# EAGLE design FES (EAGLE 9.6.2)
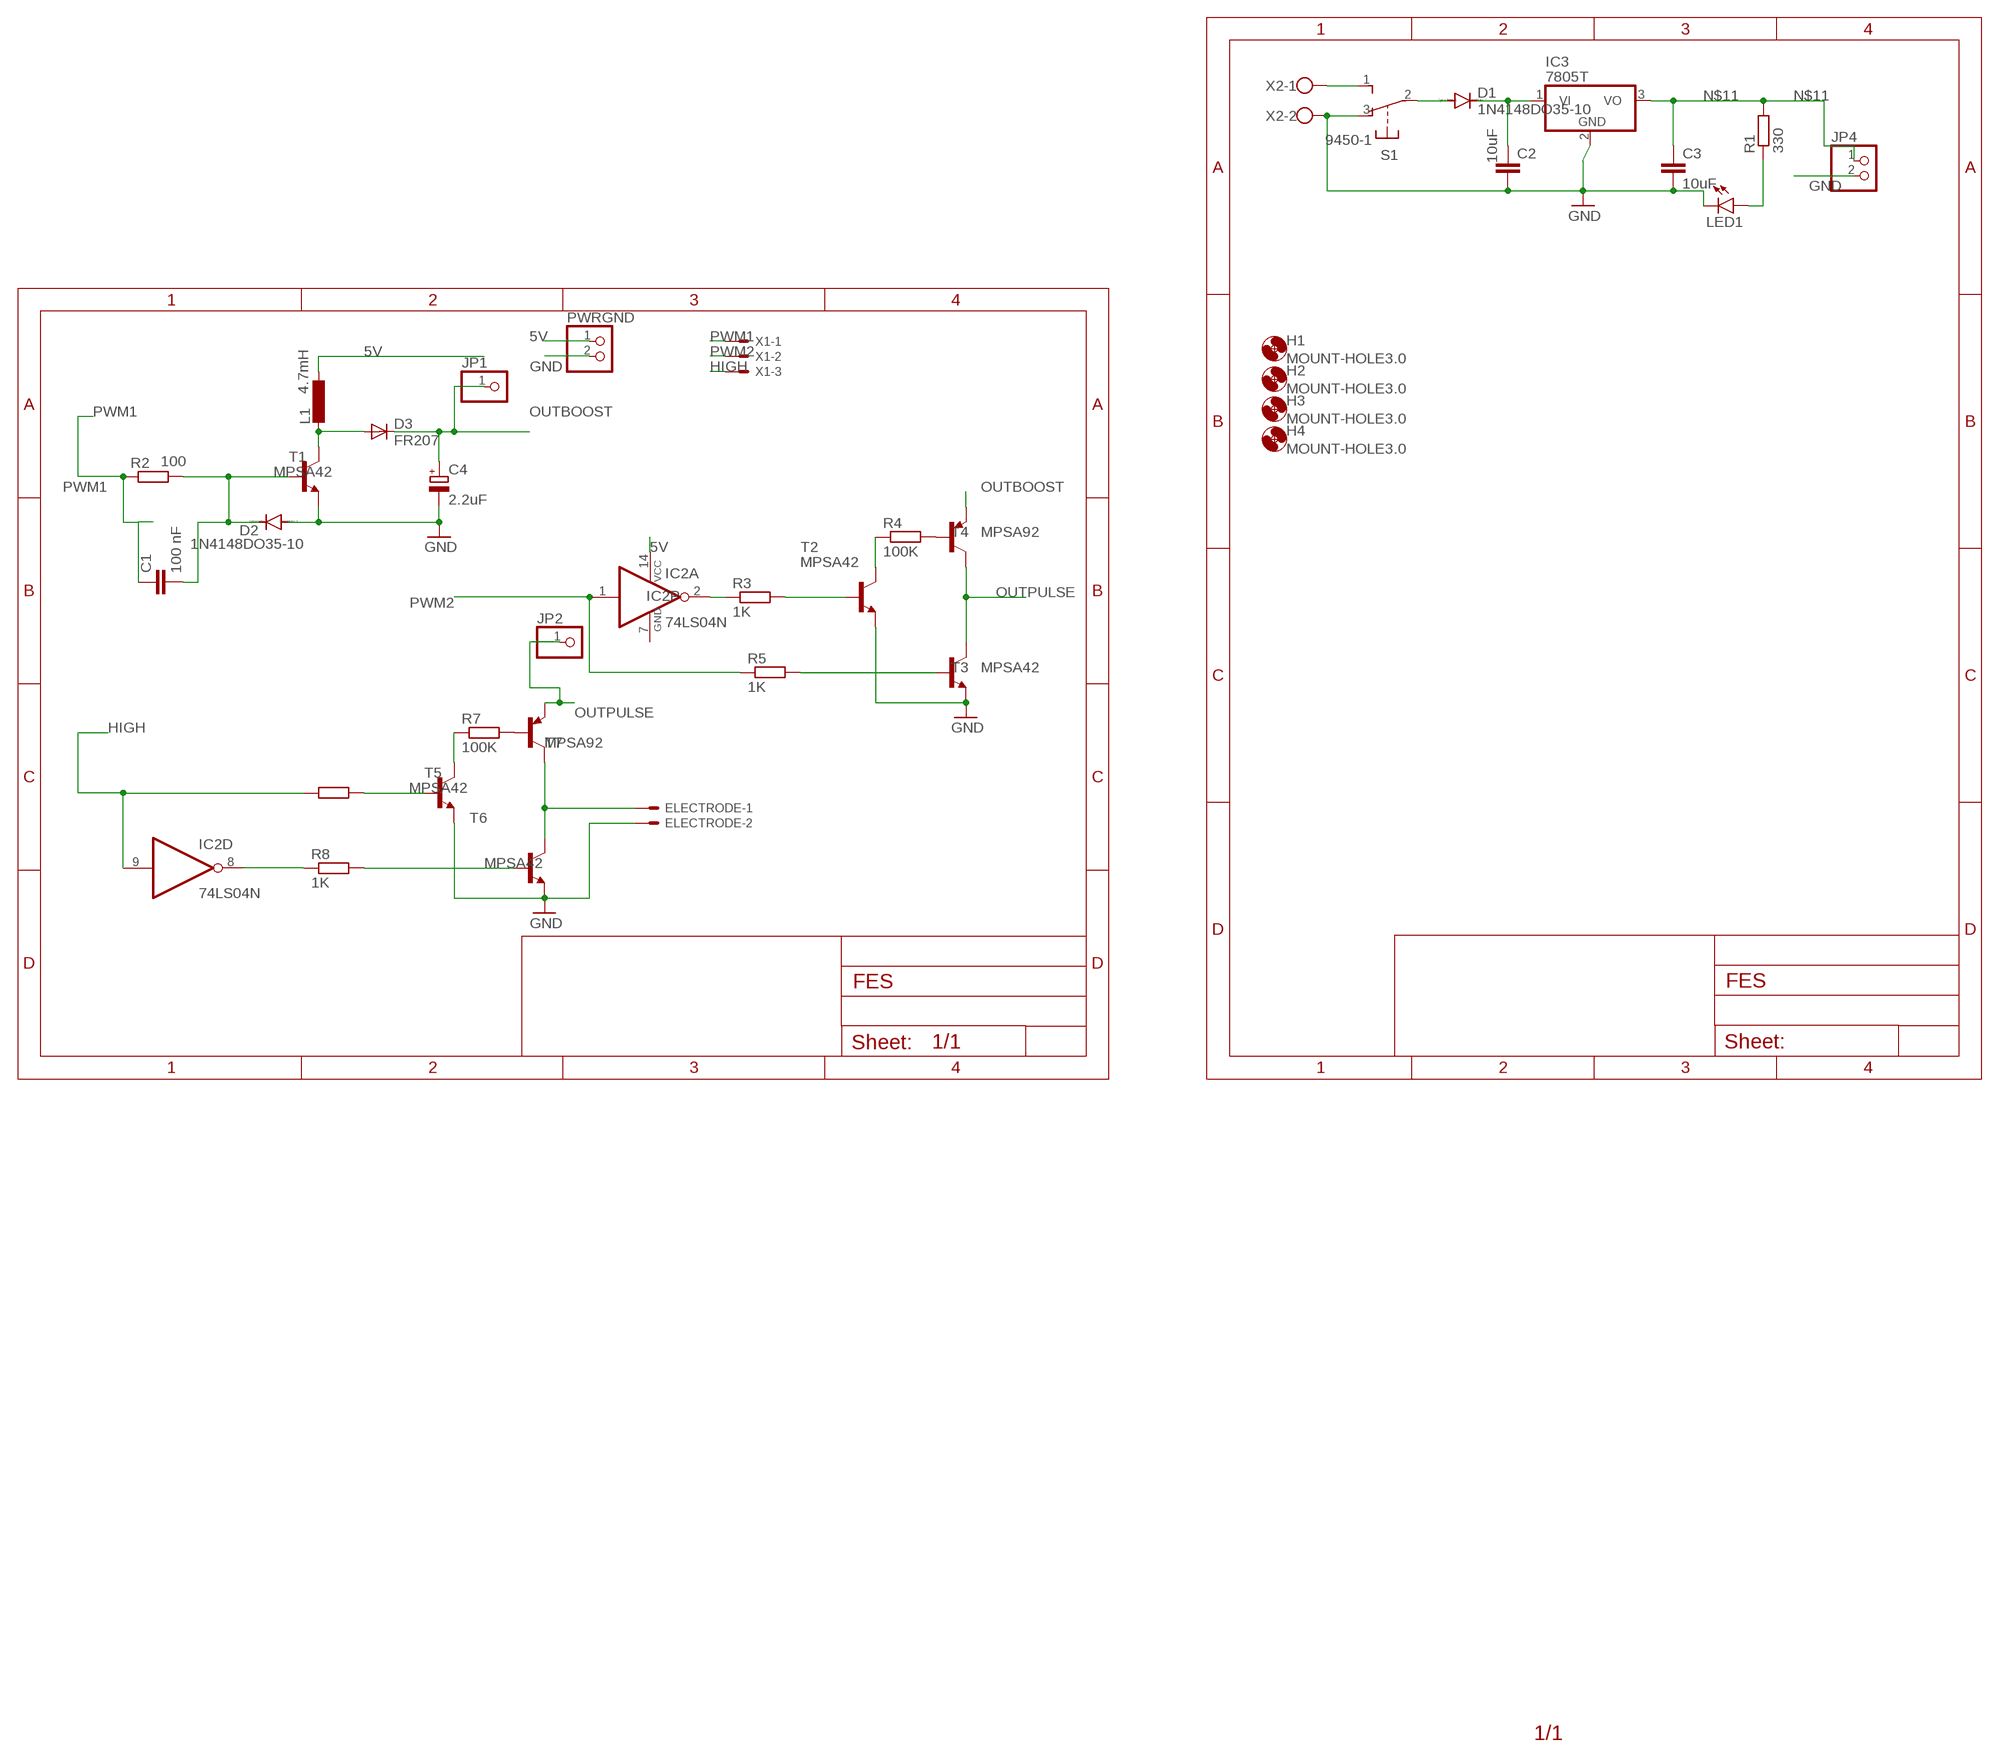
[diagram p0: schematic, sheet 1]

## Parts
C1  100 nF  C5/2.5  [C5B2.5]
C2  10uF  C2.5/2  [C2.5-2]
C3  10uF  C2.5/2  [C2.5-2]
C4  2.2uF  CPOL-EUE5-10.5  [E5-10,5]
D1  1N4148DO35-10  [DO35-10]
D2  1N4148DO35-10  [DO35-10]
D3  FR207  [DO15-12]
ELECTRODE  22-23-2021  [22-23-2021]
H1  MOUNT-HOLE3.0  [3,0]
H2  MOUNT-HOLE3.0  [3,0]
H3  MOUNT-HOLE3.0  [3,0]
H4  MOUNT-HOLE3.0  [3,0]
IC2  74LS04N  [DIL14]
IC3  7805T  [TO220H]
JP1  PINHD-1X1  [1X01]
JP2  PINHD-1X1  [1X01]
JP4  PINHD-1X2  [1X02]
L1  4.7mH  L-EU0207/12  [0207/12]
LED1  LED3MM  [LED3MM]
PWRGND  PINHD-1X2  [1X02]
R1  330  R-EU_0207/10  [0207/10]
R2  100  R-EU_0207/10  [0207/10]
R3  1K  R-EU_0207/10  [0207/10]
R4  100K  R-EU_0207/10  [0207/10]
R5  1K  R-EU_0207/10  [0207/10]
R6  1K  R-EU_0207/10  [0207/10]
R7  100K  R-EU_0207/10  [0207/10]
R8  1K  R-EU_0207/10  [0207/10]
S1  9450-1  [9450-1]
T1  MPSA42  MPSA42-NPN-TO92-EBC  [TO92-EBC]
T2  MPSA42  MPSA42-NPN-TO92-EBC  [TO92-EBC]
T3  MPSA42  MPSA42-NPN-TO92-EBC  [TO92-EBC]
T4  MPSA92  MPSA92-PNP-TO92-EBC  [TO92-EBC]
T5  MPSA42  MPSA42-NPN-TO92-EBC  [TO92-EBC]
T6  MPSA42  MPSA42-NPN-TO92-EBC  [TO92-EBC]
T7  MPSA92  MPSA92-PNP-TO92-EBC  [TO92-EBC]
X1  22-23-2031  [22-23-2031]
X2  W237-102  [W237-102]

## Nets
5V: IC2.14(P:VCC) L1.1 PWRGND.1
GND: C2.2 C3.2 C4.- D2.A ELECTRODE.2 IC3.2(GND) JP4.2 LED1.K(C) PWRGND.2 S1.3(O) T1.E T2.E T3.E T5.E T6.E X2.2
HIGH: IC2.9(D:I) R6.1 X1.3
N$1: C1.2 D2.C R2.2 T1.B
N$2: S1.1(S) X2.1
N$3: D3.A L1.2 T1.C
N$4: C2.1 D1.C IC3.1(VI)
N$5: R4.2 T4.B
N$6: IC2.2(A:O) R3.1
N$7: R3.2 T2.B
N$9: R4.1 T2.C
N$10: R7.2 T7.B
N$11: C3.1 IC3.3(VO) JP4.1 R1.2
N$12: IC2.8(D:O) R8.1
N$13: R5.2 T3.B
N$14: R6.2 T5.B
N$15: R7.1 T5.C
N$16: ELECTRODE.1 T6.C T7.C
N$17: R8.2 T6.B
N$51: LED1.A R1.1
N$52: D1.A S1.2(P)
OUTBOOST: C4.+ D3.C JP1.1 T4.E
OUTPULSE: JP2.1 T3.C T4.C T7.E
PWM1: C1.1 R2.1 X1.1
PWM2: IC2.1(A:I) R5.1 X1.2
Unconnected: IC2.3(B:I) IC2.4(B:O) IC2.5(C:I) IC2.6(C:O) IC2.10(E:O) IC2.11(E:I) IC2.12(F:O) IC2.13(F:I)

## Power pins joined to a net without a drawn wire
GND: IC2.7(P:GND)

## Library data of the parts
C1-C3 = capacitor-wima:C: CAPACITOR naming: grid - package width
C4 = rcl:CPOL-EU: POLARIZED CAPACITOR, European symbol; SPICEPREFIX: C
D1 D2 = diode:1N4148: DIODE high speed (Philips)
D3 = FR207:FR207: Fast recovery Diode 1000V 2A Check availability <https://pricing.snapeda.com/parts/FR207/Taiwan%20Semiconductor%20Corporation/view-part?ref=eda>; AVAILABILITY: In Stock; DESCRIPTION: Diode Standard 2A Through Hole DO-204AC (DO-15); MF: Taiwan Semiconductor Corporation; MP: FR207; PACKAGE: None; PRICE: None; PURCHASE-URL: https://pricing.snapeda.com/search/part/FR207/?ref=eda
ELECTRODE = con-molex:22-23-2021: .100" (2.54mm) Center Header - 2 Pin; MF: MOLEX; MPN: 22-23-2021; OC_FARNELL: 1462926; OC_NEWARK: 25C3832
H1-H4 = holes:MOUNT-HOLE: MOUNTING HOLE with drill center marker
IC2 = 74xx-eu:74*04: Hex INVERTER
IC3 = linear:78*: Positive VOLTAGE REGULATOR Source: http://cache.national.com/ds/LM/LM78L05.pdf http://www.fairchildsemi.com/ds/LM/LM7805.pdf
JP1 JP2 = pinhead:PINHD-1X1: PIN HEADER
JP4 PWRGND = pinhead:PINHD-1X2: PIN HEADER
L1 = rcl:L-EU: INDUCTOR, European symbol; SPICEPREFIX: L
LED1 = led:LED: LED OSRAM: - CHIPLED LG R971, LG N971, LY N971, LG Q971, LY Q971, LO R971, LY R971 LH N974, LH R974 LS Q976, LO Q976, LY Q976 LO Q996 - Hyper CHIPLED LW Q18S LB Q993, LB Q99A, LB R99A - SideLED LS A670, LO A670, LY A670, LG A670, LP A670 LB A673, LV A673, LT A673, LW A673 LH A674 LY A675 LS A676, LA A676, LO A676, LY A676, LW A676 LS A679, LY A679, LG A679 - Hyper Micro SIDELED® LS Y876, LA Y876, LO Y876, LY Y876 LT Y87S - SmartLED LW L88C, LW L88S LB L89C, LB L89S, LG L890 LS L89K, LO L89K, LY L89K LS L896, LA L896, LO L896, LY L896 - TOPLED LS T670, LO T670, LY T670, LG T670, LP T670 LSG T670, LSP T670, LSY T670, LOP T670, LYG T670 LG T671, LOG T671, LSG T671 LB T673, LV T673, LT T673, LW T673 LH T674 LS T676, LA T676, LO T676, LY T676, LB T676, LH T676, LSB T676, LW T676 LB T67C, LV T67C, LT T67C, LS T67K, LO T67K, LY T67K, LW E67C LS E67B, LA E67B, LO E67B, LY E67B, LB E67C, LV E67C, LT E67C LW T67C LS T679, LY T679, LG T679 LS T770, LO T770, LY T770, LG T770, LP T770 LB T773, LV T773, LT T773, LW T773 LH T774 LS E675, LA E675, LY E675, LS T675 LS T776, LA T776, LO T776, LY T776, LB T776 LHGB T686 LT T68C, LB T68C - Hyper Mini TOPLED® LB M676 - Mini TOPLED Santana® LG M470 LS M47K, LO M47K, LY M47K Source: http://www.osram.convergy.de LUXEON: - LUMILED® LXK2-PW12-R00, LXK2-PW12-S00, LXK2-PW14-U00, LXK2-PW14-V00 LXK2-PM12-R00, LXK2-PM12-S00, LXK2-PM14-U00 LXK2-PE12-Q00, LXK2-PE12-R00, LXK2-PE12-S00, LXK2-PE14-T00, LXK2-PE14-U00 LXK2-PB12-K00, LXK2-PB12-L00, LXK2-PB12-M00, LXK2-PB14-N00, LXK2-PB14-P00, LXK2-PB14-Q00 LXK2-PR12-L00, LXK2-PR12-M00, LXK2-PR14-Q00, LXK2-PR14-R00 LXK2-PD12-Q00, LXK2-PD12-R00, LXK2-PD12-S00 LXK2-PH12-R00, LXK2-PH12-S00 LXK2-PL12-P00, LXK2-PL12-Q00, LXK2-PL12-R00 Source: www.luxeon.com KINGBRIGHT: KA-3528ASYC Source: www.kingbright.com
R1-R8 = rcl:R-EU_: RESISTOR, European symbol; SPICEPREFIX: R
S1 = switch-misc:9450-1: MARQUARDT SWITCH
T1-T3 T5 T6 = transistor:*-NPN-: NPN Transistror BF959 corrected 2008.03.06
T4 T7 = transistor:*-PNP-: PNP Transistror
X1 = con-molex:22-23-2031: .100" (2.54mm) Center Header - 3 Pin; MF: MOLEX; MPN: 22-23-2031; OC_FARNELL: 1462950; OC_NEWARK: 30C0862
X2 = con-wago-500:W237-102: WAGO SCREW CLAMP; MPN: 237-102; OC_FARNELL: unknown; OC_NEWARK: 70K9898

## Net classes
0 default: width 0.61 mm

## Board
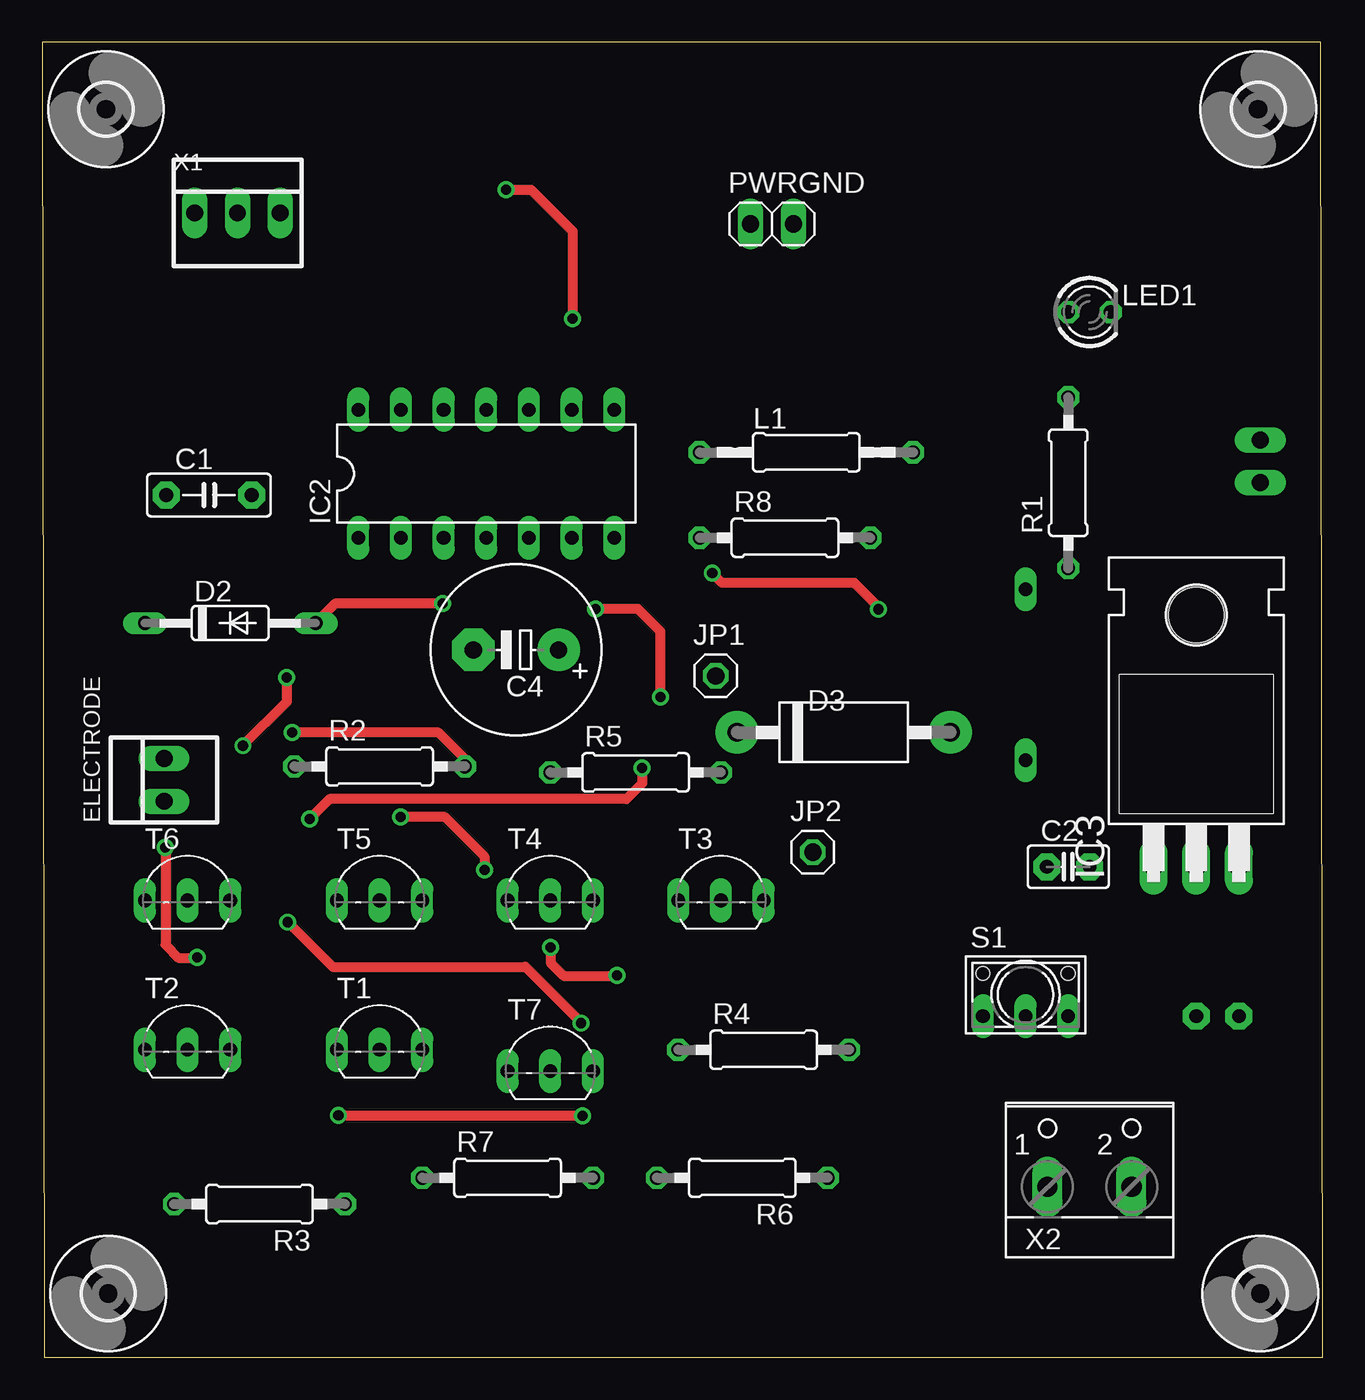
[diagram p1: board, top side]
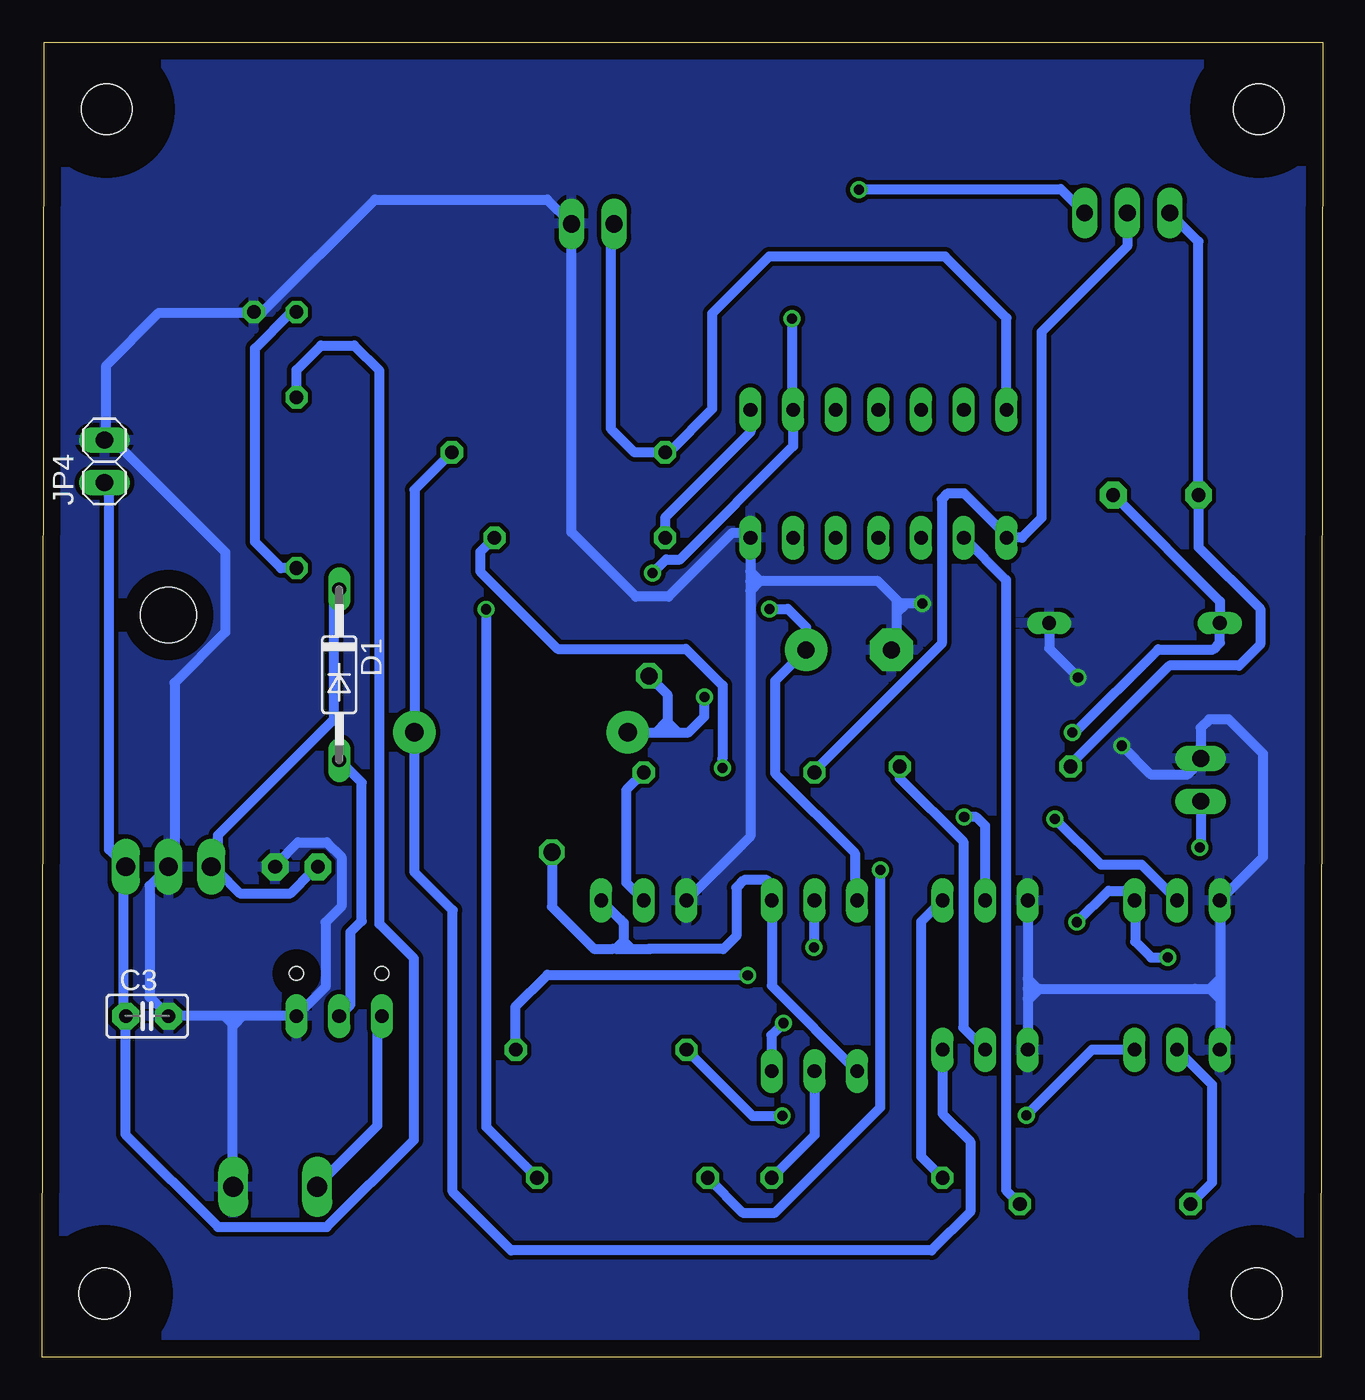
[diagram p2: board, bottom side, seen from below]

Size 76.24 x 78.3 mm. Coordinates in mm from the lower left corner, seen from the top.
Outline: 0.13,0 76.24,0 76.11,78.3 0,78.3 0.13,0
Copper layers (1*16): Top 0.035mm / dielectric 1.5mm / Bottom 0.035mm
Design rules "default *": minimum track width 10mil, minimum drill 0.6mm, track to track 10mil, track to pad 10mil, pad to pad 10mil, via to via 10mil, smd to smd 10mil, copper to edge 40mil, drill to drill 6mil, minimum pad ring 10mil, minimum via ring 8mil, stop-mask expansion 4mil, vias tented up to drill 0mil, thermal gap 10mil

### Footprints (pad centres in the part's own frame; a part is rotated, then mirrored left to right if it is on the bottom)
C5B2.5 = drill 0.813 pad 1.6 octagon: 1 -2.54,0; 2 2.54,0
C2.5-2 = drill 0.813 pad 1.6 octagon: 1 -1.27,0; 2 1.27,0
E5-10,5 = drill 1.016 pad 2.54: + -2.54,0 | drill 1.016 pad 2.54 octagon: - 2.54,0
DO35-10 = drill 0.813 long: A 5.08,0; C -5.08,0
DO15-12 = drill 1.118 pad 2.54: A 6.35,0; C -6.35,0
22-23-2021 = drill 1 long: 1 -1.27,0; 2 1.27,0
3,0 = hole 3: 0,0
DIL14 = drill 0.813 long: 1 -7.62,-3.81; 2 -5.08,-3.81; 3 -2.54,-3.81; 4 0,-3.81; 5 2.54,-3.81; 6 5.08,-3.81; 7 7.62,-3.81; 8 7.62,3.81; 9 5.08,3.81; 10 2.54,3.81; 11 0,3.81; 12 -2.54,3.81; 13 -5.08,3.81; 14 -7.62,3.81
TO220H = drill 1.118 long: 1 -2.54,-10.16; 2 0,-10.16; 3 2.54,-10.16 | hole 3.302: 0,4.826
1X01 = drill 1.016 octagon: 1 0,0
1X02 = drill 1.016 long: 1 -1.27,0; 2 1.27,0
0207/12 = drill 0.813 octagon: 1 -6.35,0; 2 6.35,0
LED3MM = drill 0.813 octagon: A -1.27,0; K 1.27,0
0207/10 = drill 0.813 octagon: 1 -5.08,0; 2 5.08,0
9450-1 = drill 0.813 long: 1 -2.54,-1.27; 2 0,-1.27; 3 2.54,-1.27 | hole 0.813: 2.54,1.27; -2.54,1.27
TO92-EBC = drill 0.813 long: B 0,-1.27; C 2.54,-1.27; E -2.54,-1.27
22-23-2031 = drill 1 long: 1 -2.54,0; 2 0,0; 3 2.54,0
W237-102 = drill 1.194 long: 1 -2.5,-1.27; 2 2.5,-1.27

### Placement (x,y rotation side)
C1  9.93,51.34 0 top
C2  61.09,29.21 0 top
C3  69.98,20.32 0 bottom
C4  28.22,42.12 180 top
D1  58.55,40.64 270 bottom
D2  11.2,43.72 0 top
D3  47.72,37.21 0 top
ELECTRODE  7.27,34.38 90 top
H1  72.52,3.81 0 top
H2  3.94,3.81 0 top
H3  72.39,74.3 0 top
H4  3.81,74.3 0 top
IC2  26.44,52.61 0 top
IC3  68.71,39.37 0 top
JP1  40.1,40.57 0 top
JP2  45.88,30.08 0 top
JP4  72.52,53.34 90 bottom
L1  45.49,53.88 0 top
LED1  62.36,62.23 0 top
PWRGND  43.45,67.47 0 top
R1  61.09,52.07 90 top
R2  20.09,35.18 0 top
R3  12.95,9.13 180 top
R4  42.95,18.32 0 top
R5  35.33,34.83 0 top
R6  41.68,10.7 180 top
R7  27.71,10.7 0 top
R8  44.22,48.8 0 top
S1  58.55,21.59 0 top
T1  20.09,19.59 0 top
T2  8.66,19.59 0 top
T3  40.41,28.48 0 top
T4  30.25,28.48 0 top
T5  20.09,28.48 0 top
T6  8.66,28.48 0 top
T7  30.25,18.32 0 top
X1  11.64,68.12 0 top
X2  62.36,11.43 0 top

### Tracks (layer width: path | path; a pad name or v marks a point on that pad's centre or on a via)
5V
  Bottom 0.61: PWRGND.1 42.39,67.27 42.39,55.3 40.96,53.88 L1.1 38.92,53.88 36.34,56.45 36.34,62.14 32.95,65.53 22.48,65.53 18.82,61.88 IC2.14
GND  (via drill 0.6)
  Top 0.61: v23.84,44.88 17.45,44.88 D2.A | v14.56,40.48 14.56,39.02 v11.96,36.42
  Bottom 0.61: 6.09,22.58 6.09,27.17 T6.E 3.56,29.77 3.56,35.94 5.6,37.99 6.77,37.99 7.27,37.49 ELECTRODE.2 7.27,35.49 8.05,34.71 10.25,34.71 v11.96,36.42 | 6.09,22.58 6.09,21.95 | 6.09,21.95 6.09,21.32 | 6.09,21.32 6.09,18.35 T2.E | T5.E 17.55,22.54 | 17.55,22.54 17.55,21.95 | 17.55,21.95 17.55,21.36 | 17.55,21.36 T1.E | 17.55,21.95 16.88,21.95 | 16.88,21.95 7.6,21.95 6.72,21.95 | 6.72,21.95 6.71,21.95 | 6.71,21.95 6.09,21.95 | T3.E 34.06,31.02 34.06,45.63 | 34.06,46.79 IC2.7 34.37,49.1 35.12,49.1 38.94,45.28 40.88,45.28 44.72,49.12 PWRGND.2 46.17,68.93 56.42,68.93 63.13,62.22 LED1.K 64.03,62.18 69.28,62.18 72.4,59.05 72.4,54.72 JP4.2 72.24,54.84 65.33,47.93 65.33,43.18 68.35,40.16 68.35,29.36 IC3.2 69.84,28.08 69.84,21.45 C3.2 65.39,20.32 | 34.06,46.79 34.06,46.22 | 34.06,46.22 34.06,45.63 | D2.A 16.28,42.2 v14.56,40.48 | 25.34,44.34 25.34,42.46 C4.- | v23.84,44.88 24.9,44.88 | 24.9,44.88 25.14,44.88 25.34,45.08 | C2.2 62.3,29.36 61.01,30.66 59.28,30.66 58.41,29.79 58.41,26.85 59.36,25.9 59.36,22.05 S1.3 64.31,20.32 | X2.2 64.9,10.36 64.9,19.83 | 64.31,20.32 64.94,20.32 | 64.94,20.32 65.39,20.32 | 64.94,20.32 64.9,20.27 64.9,19.83 | 64.9,19.83 65.39,20.32 | 64.9,19.83 64.8,19.83 64.31,20.32 | 6.09,22.58 6.72,21.95 | 6.09,21.32 6.71,21.95 | 16.88,21.95 16.96,21.95 17.55,22.54 | 16.88,21.95 17.47,21.36 17.55,21.36 | 34.06,46.22 34.06,46.21 33.49,46.21 | 33.49,46.21 26.47,46.21 25.44,45.18 25.34,45.08 | 33.49,46.21 34.06,46.79 | 33.49,46.21 34.06,45.63 | 25.34,44.34 24.9,44.77 24.9,44.88 | 25.34,44.34 25.34,45.08
  pour Bottom: -1.14,78.74 -1.14,-1.27 77.6,-1.27 77.6,78.74
HIGH  (via drill 0.6)
  Top 0.61: v49.79,44.53 49.79,44.66 48.35,46.1 40.49,46.1 v39.89,46.7 | v27.62,69.51 29.12,69.51 31.59,67.04 v31.59,61.84
  Bottom 0.61: v49.79,44.53 49.79,13.72 R6.1 | v27.62,69.51 27.58,69.55 15.6,69.55 X1.3 | v31.59,61.84 31.59,56.48 IC2.9 31.52,54.24 38.25,47.51 39.08,47.51 v39.89,46.7
N$1  (via drill 0.6)
  Top 0.61: v14.9,37.19 23.6,37.19 25.17,35.61 R2.2
  Bottom 0.61: C1.2 12.45,51.34 6.12,45.01 D2.C 6.12,42.55 6.52,42.15 9.79,42.15 14.75,37.19 v14.9,37.19 | T1.B 21.4,19.62 21.4,30.7 25.17,34.48 R2.2
N$2
  Bottom 0.61: S1.1 56.26,20.3 56.26,13.82 59.71,10.36 X2.1
N$3
  Bottom 0.61: L1.2 54.06,51.66 D3.A 54.07,28.92 54.08,28.91 51.79,26.62 51.79,9.87 48.31,6.38 23.28,6.38 20.99,8.67 20.99,12.86 22.63,14.51 T1.C
N$4
  Bottom 0.61: D1.C 58.85,45.34 58.85,38 65.76,31.09 65.76,29.36 IC3.1 65.76,28.93 64.46,27.64 61.44,27.64 60.15,28.93 C2.1
N$5  (via drill 0.6)
  Top 0.61: v34.23,22.74 34.23,22.69 31.08,22.69 30.28,23.49 v30.28,24.4
  Bottom 0.61: v30.28,24.4 30.25,24.43 T4.B | R4.2 48.06,18.35 48.06,20.87 46.15,22.78 34.27,22.78 v34.23,22.74
N$6
  Bottom 0.61: R3.1 18.85,9.96 18.85,46.28 IC2.2
N$7
  Bottom 0.61: T2.B 6.6,16.25 6.6,10.4 R3.2
N$9  (via drill 0.6)
  Top 0.61: v32.17,14.38 32.17,14.41 v17.64,14.41
  Bottom 0.61: v17.64,14.41 13.74,18.32 T2.C | R4.1 33.94,14.38 v32.17,14.38
N$10
  Bottom 0.61: R7.2 30.25,13.24 T7.B
N$11
  Bottom 0.61: JP4.1 72.24,51.82 72.24,30.23 71.37,29.36 IC3.3 71.37,28.93 71.37,20.73 C3.1 71.27,20.29 71.27,13.29 65.76,7.77 59.28,7.77 54.1,12.95 54.1,23.75 56.15,25.8 56.15,58.73 57.66,60.24 59.63,60.24 61.09,58.78 R1.2
N$12
  Bottom 0.61: R8.1 39.14,49.99 34.06,55.07 IC2.8
N$13
  Bottom 0.61: R5.2 41.47,33.77 41.47,28.26 T3.B
N$14  (via drill 0.6)
  Top 0.61: v26.33,29.01 26.33,29.82 23.99,32.17 v21.35,32.17
  Bottom 0.61: v26.33,29.01 26.33,14.89 32.6,8.62 34.53,8.62 R6.2 | T5.B 20.09,31.64 20.63,32.17 v21.35,32.17
N$15
  Bottom 0.61: R7.1 23.9,11.97 23.9,25.94 T5.C
N$16  (via drill 0.6)
  Top 0.61: v7.33,30.35 7.35,30.33 7.35,24.57 8.12,23.8 v9.22,23.8 v9.23,23.8 | v32.09,19.9 32.09,19.93 28.78,23.25 17.29,23.25 v14.63,25.91
  Bottom 0.61: v14.63,25.91 12.76,27.78 11.78,27.78 T6.C 11.16,27.16 11.16,24.76 10.21,23.8 v9.23,23.8 | v32.09,19.9 32.82,19.18 32.82,17.07 T7.C | v7.33,30.35 7.27,30.41 ELECTRODE.1
N$17  (via drill 0.6)
  Top 0.61: v35.73,35.08 35.73,34.18 34.79,33.24 17.11,33.24 v15.94,32.07
  Bottom 0.61: v15.94,32.07 13.21,29.34 10.8,29.34 T6.B | R8.2 50.15,47.95 50.15,46.78 45.55,42.18 37.91,42.18 35.73,40 35.73,35.71 v35.73,35.08
N$51
  Bottom 0.61: LED1.A 61.44,62.18 63.56,60.06 63.56,48.54 62.01,46.99 R1.1
N$52
  Bottom 0.61: D1.A 57.21,34.22 57.21,25.98 57.87,25.32 57.87,20.99 S1.2
OUTBOOST  (via drill 0.6)
  Top 0.61: v36.81,39.31 36.81,43.22 35.47,44.56 v32.94,44.56
  Bottom 0.61: T4.E 27.86,27.35 27.86,30.02 32.6,34.77 32.6,40.28 C4.+ 30.76,43.47 31.84,44.56 v32.94,44.56 | D3.C 39.66,37.21 | 39.66,37.21 39.01,37.21 | 39.01,37.21 38.41,37.21 | 38.41,37.21 37.75,37.21 36.81,38.14 v36.81,39.31 | JP1.1 39.01,39.48 39.01,37.82 | 39.01,37.21 39.01,37.82 | 39.01,37.82 38.41,37.22 38.41,37.21 | 39.01,37.82 39.05,37.82 39.66,37.21
OUTPULSE
  Bottom 0.61: T7.E 32.79,22.13 T4.C 32.79,28.13 33.08,28.42 34.45,28.42 34.91,27.96 34.91,25.09 35.68,24.32 40.07,24.32 40.08,24.33 41.14,24.33 | JP2.1 45.88,26.82 43.39,24.33 42.24,24.33 42.09,24.33 | 42.09,24.33 41.61,24.33 | 41.61,24.33 41.14,24.33 | T3.C 41.88,26.13 41.86,26.13 41.61,25.88 41.61,24.81 | 41.61,24.81 41.61,24.33 | 41.61,24.81 41.14,24.33 | 41.61,24.81 42.09,24.33
PWM1
  Bottom 0.61: R2.1 15.01,35.29 9.12,41.18 4.98,41.18 3.73,42.43 3.73,44.57 7.39,48.23 C1.1 7.39,66.42 X1.1
PWM2
  Bottom 0.61: R5.1 30.25,34.91 22.68,42.48 22.68,51.08 22.31,51.45 21.36,51.45 18.82,48.91 IC2.1 17.91,48.8 16.74,49.97 16.74,61.04 11.64,66.14 X1.2